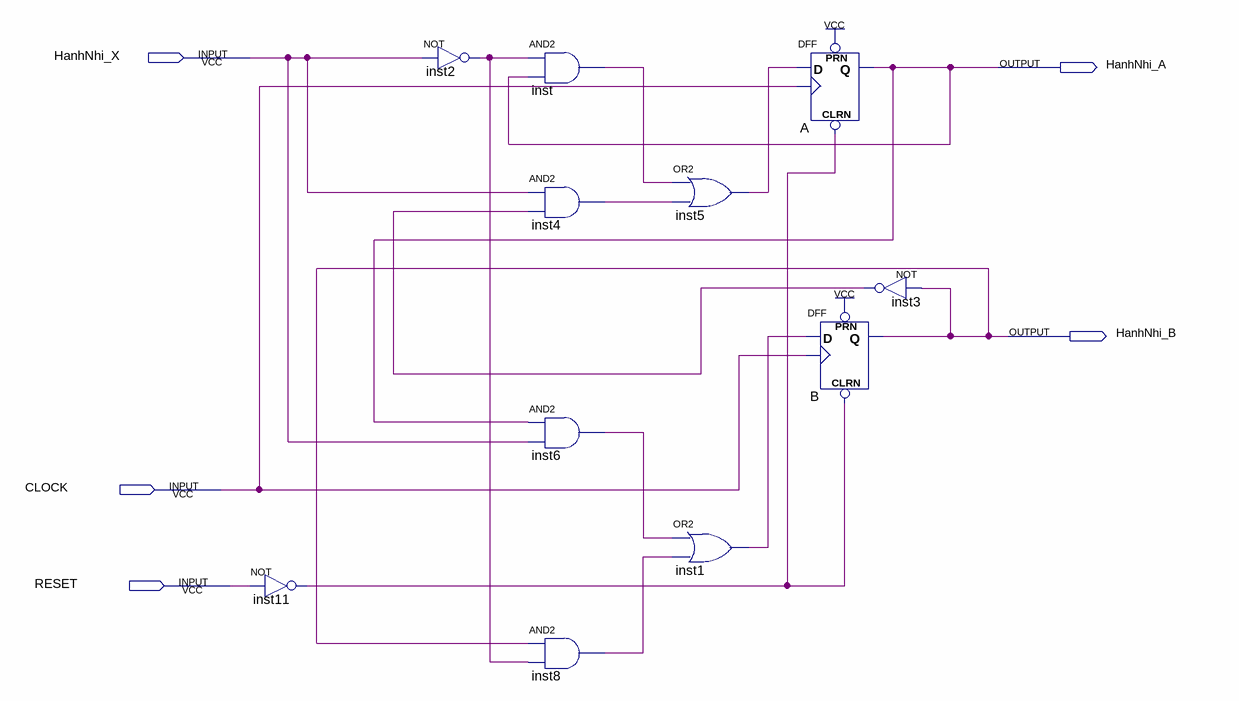
[diagram p0: schematic sheet]
// Quartus schematic Assignment5.bdf as structural Verilog: 11 symbols, 5 pins
module Assignment5 (
  input  HanhNhi_X,
  input  CLOCK,
  input  RESET,
  output HanhNhi_A,
  output HanhNhi_B
);

  wire inst1_out, inst2_out, inst3_out, inst4_out, inst5_out, inst6_out, inst8_out, inst11_out, inst_out;

  not inst11 (inst11_out, RESET);
  not inst2 (inst2_out, HanhNhi_X);
  and inst (inst_out, inst2_out, HanhNhi_A);
  and inst4 (inst4_out, HanhNhi_X, inst3_out);
  and inst6 (inst6_out, HanhNhi_A, HanhNhi_X);
  and inst8 (inst8_out, HanhNhi_B, inst2_out);
  or inst5 (inst5_out, inst_out, inst4_out);
  or inst1 (inst1_out, inst6_out, inst8_out);
  DFF A (.CLRN(inst11_out), .CLK(CLOCK), .D(inst5_out), .PRN(1'b1), .Q(HanhNhi_A));
  DFF B (.CLRN(inst11_out), .CLK(CLOCK), .D(inst1_out), .PRN(1'b1), .Q(HanhNhi_B));
  not inst3 (inst3_out, HanhNhi_B);
endmodule
